# EAGLE schematic Embedded (EAGLE 7.4.0)
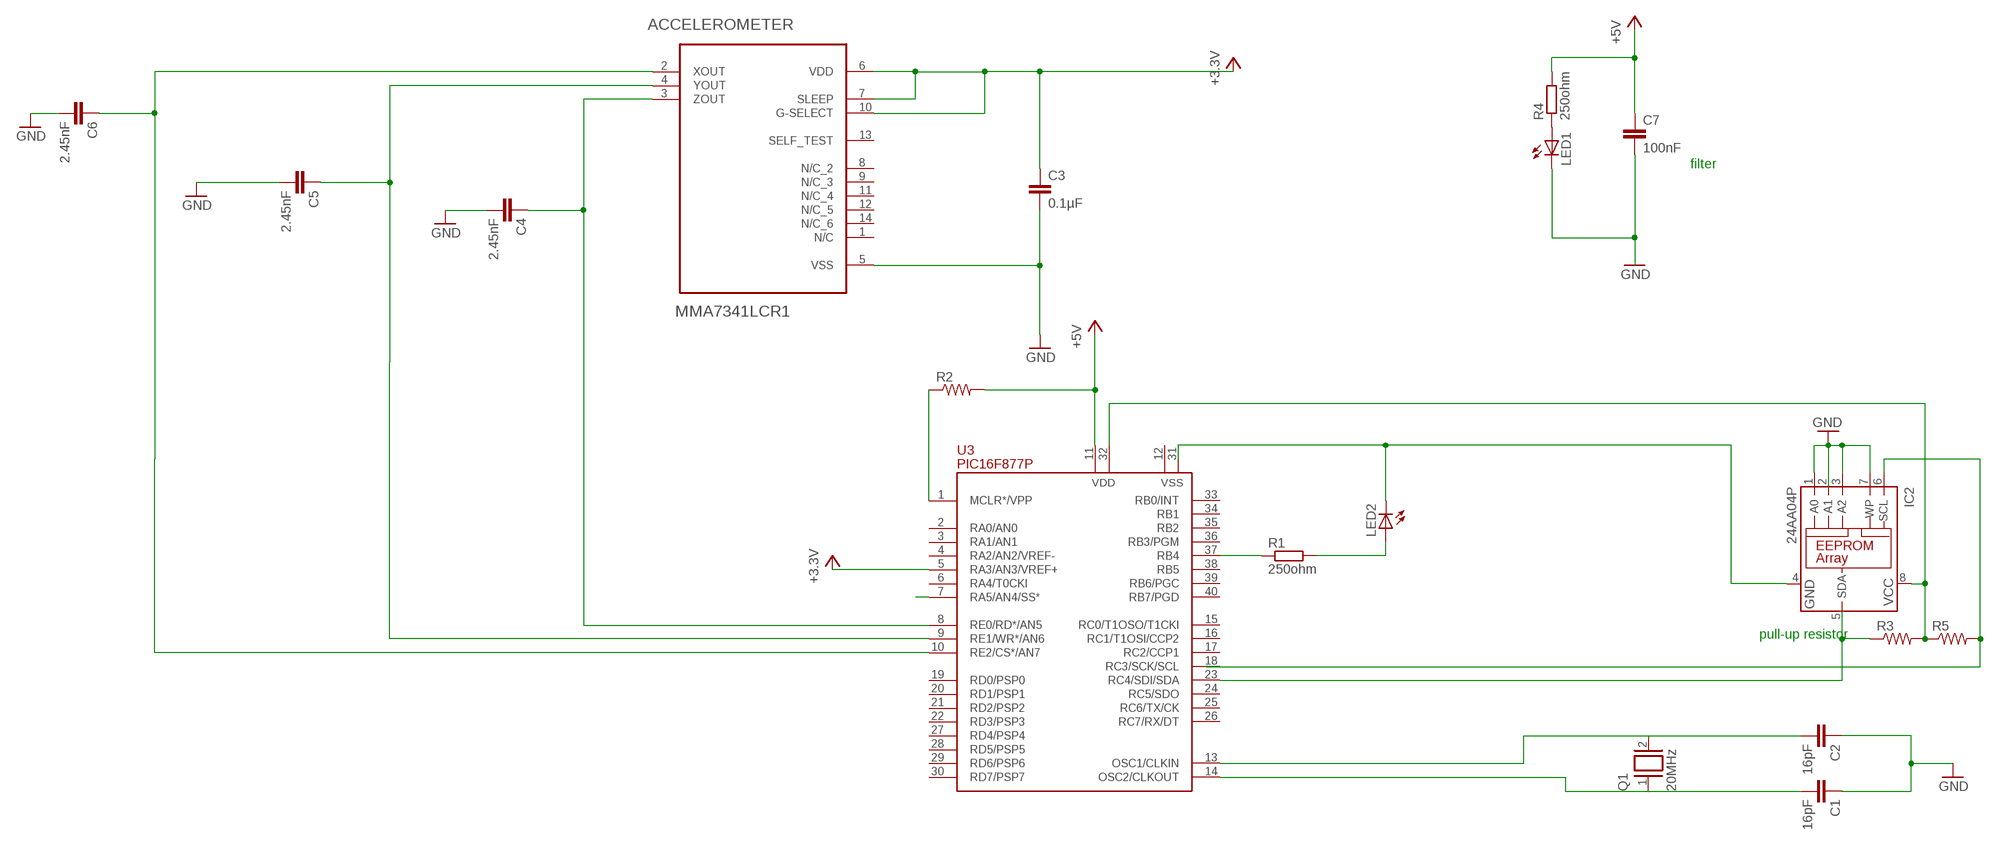
[diagram p0: schematic, sheet 1]

## Parts
ACCELEROMETER  MMA7341LCR1  [LGA14R80P1X6_500X300X100]
C1  16pF  C5/2.5  [C5B2.5]
C2  16pF  C5/2.5  [C5B2.5]
C3  0.1µF  C5/2.5  [C5B2.5]
C4  2.45nF  C5/2.5  [C5B2.5]
C5  2.45nF  C5/2.5  [C5B2.5]
C6  2.45nF  C5/2.5  [C5B2.5]
C7  100nF  C5/2.5  [C5B2.5]
IC2  24AA04P  [DIL8]
LED1  LAP4-BOTTOM  [P47F-BOTTOM]
LED2  LAW51M  [W51]
Q1  20MHz  XTAL/S  [QS]
R1  250ohm  R-EU_0204/7  [0204/7]
R2  R-US_0204/2V  [0204V]
R3  R-US_0204/2V  [0204V]
R4  250ohm  R-EU_0204/7  [0204/7]
R5  R-US_0204/2V  [0204V]
U3  PIC16F877P  [DIL40]

## Nets
+5V: ACCELEROMETER.6(VDD) ACCELEROMETER.7(SLEEP) ACCELEROMETER.10(G-SELECT) C3.1 C7.1 R2.2 R4.2 U3.5(RA3/AN3/VREF+) U3.11(VDD) ; supply symbol labelled +3.3V
GND: ACCELEROMETER.5(VSS) C1.1 C2.1 C3.2 C4.2 C5.2 C6.2 IC2.1(A0) IC2.3(A2) IC2.7(WP)
N$1: R3.1 U3.23(RC4/SDI/SDA)
N$2: IC2.6(SCL) R5.2
N$3: C2.2 Q1.2 U3.13(OSC1/CLKIN)
N$4: C1.2 Q1.1 U3.14(OSC2/CLKOUT)
N$5: C7.2 LED1.C
N$6: R2.1 U3.1(MCLR*/VPP)
N$7: R1.1 U3.37(RB4)
N$8: IC2.8(VCC) R3.2 R5.1 U3.32(VDD)
N$9: LED2.A R1.2
N$10: LED1.A R4.1
N$11: IC2.4(GND) LED2.C
N$12: ACCELEROMETER.3(ZOUT) C4.1 U3.8(RE0/RD*/AN5)
N$15: ACCELEROMETER.4(YOUT) C5.1 U3.9(RE1/WR*/AN6)
N$16: ACCELEROMETER.2(XOUT) C6.1 U3.10(RE2/CS*/AN7)
N$17: U3.7(RA5/AN4/SS*)
Unconnected: ACCELEROMETER.1(N/C) ACCELEROMETER.8(N/C_2) ACCELEROMETER.9(N/C_3) ACCELEROMETER.11(N/C_4) ACCELEROMETER.12(N/C_5) ACCELEROMETER.13(SELF_TEST) ACCELEROMETER.14(N/C_6) IC2.2(A1) IC2.5(SDA) LED2.TH@1(TH) LED2.TH@2(TH) LED2.TH@3(TH) U3.2(RA0/AN0) U3.3(RA1/AN1) U3.4(RA2/AN2/VREF-) U3.6(RA4/T0CKI) U3.12(VSS) U3.15(RC0/T1OSO/T1CKI) U3.16(RC1/T1OSI/CCP2) U3.17(RC2/CCP1) U3.18(RC3/SCK/SCL) U3.19(RD0/PSP0) U3.20(RD1/PSP1) U3.21(RD2/PSP2) U3.22(RD3/PSP3) U3.24(RC5/SDO) U3.25(RC6/TX/CK) U3.26(RC7/RX/DT) U3.27(RD4/PSP4) U3.28(RD5/PSP5) U3.29(RD6/PSP6) U3.30(RD7/PSP7) U3.31(VSS) U3.33(RB0/INT) U3.34(RB1) U3.35(RB2) U3.36(RB3/PGM) U3.38(RB5) U3.39(RB6/PGC) U3.40(RB7/PGD)

## Notes on the sheet
- filter
- pull-up resistor

## Library data of the parts
ACCELEROMETER = Freescale_By_element14_Batch_1:MMA7341LCR1: ±3g, ±11g Three Axis Low-g Micromachined Accelerometer; MPN: MMA7341LCR1; OC_FARNELL: -; OC_NEWARK: 74R8752; PACKAGESTYLE: LGA-14; SUPPLIER: Freescale
C1-C7 = capacitor-wima:C: CAPACITOR naming: grid - package width
IC2 = microchip:24*: Serial EEPROM I2C; MPN: 24AA04-I/P; OC_FARNELL: 1331275; OC_NEWARK: 35M0696
LED1 = led:*P4: PointLED® Enhanced Thinfilm LED TOP & BOTTOM mount LS P47F, LR P47F, LA P47F, LY P47F, LT P4SG, LB P4SG, LW P4SG Source: http://catalog.osram-os.com .. LA_LR_LS_LY_P47F_Pb_free.pdf
LED2 = led:*W51M: Golden DRAGON® with Lens Enhanced Thinfilm LED Source: LA_LR_LY_W51M_Pb_free[1].pdf
Q1 = special:XTAL/S: CRYSTAL
R1 R4 = rcl:R-EU_: RESISTOR, European symbol
R2 R3 R5 = resistor:R-US_: RESISTOR, American symbol
U3 = pic16f87x:PIC16F877: FLASH MICROCONTROLLER